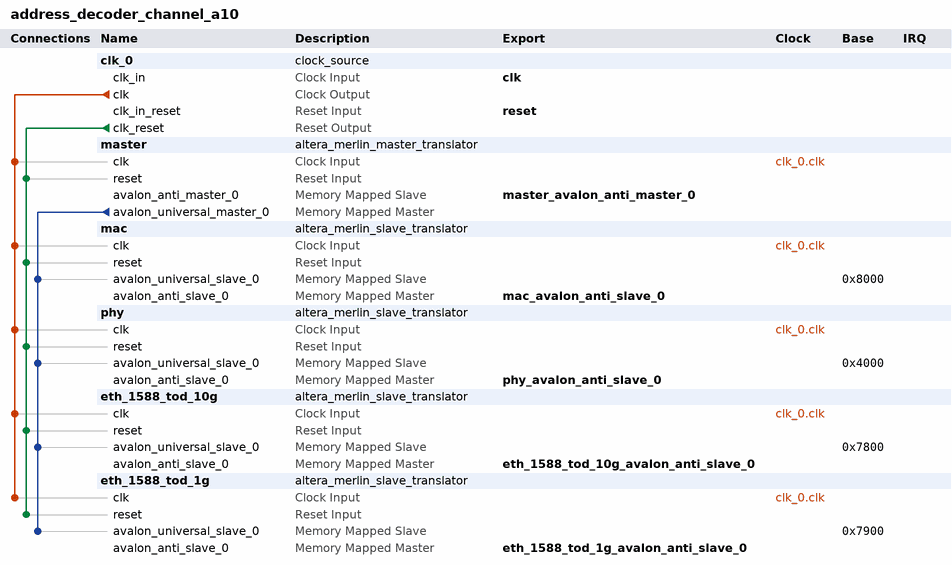
[diagram p0: system contents]
# Platform Designer (Qsys) system address_decoder_channel_a10, Arria 10 10AX115S4F45I3SGE2
# Parameters at their usual value, and those the tool derives, are not listed.
package require -exact qsys 16.1
create_system address_decoder_channel_a10
set_project_property DEVICE_FAMILY {Arria 10}
set_project_property DEVICE 10AX115S4F45I3SGE2

add_instance clk_0 clock_source 16.1
set_instance_parameter_value clk_0 clockFrequency 100000000

add_instance master altera_merlin_master_translator 16.1
set_instance_parameter_value master AV_ADDRESSGROUP 0
set_instance_parameter_value master AV_ADDRESS_SYMBOLS 1
set_instance_parameter_value master AV_ADDRESS_W 16
set_instance_parameter_value master AV_ALWAYSBURSTMAXBURST 0
set_instance_parameter_value master AV_BITS_PER_SYMBOL 8
set_instance_parameter_value master AV_BURSTBOUNDARIES 0
set_instance_parameter_value master AV_BURSTCOUNT_SYMBOLS 1
set_instance_parameter_value master AV_BURSTCOUNT_W 3
set_instance_parameter_value master AV_BYTEENABLE_W 4
set_instance_parameter_value master AV_CONSTANT_BURST_BEHAVIOR 0
set_instance_parameter_value master AV_DATA_HOLD 0
set_instance_parameter_value master AV_DATA_W 32
set_instance_parameter_value master AV_INTERLEAVEBURSTS 0
set_instance_parameter_value master AV_ISBIGENDIAN 0
set_instance_parameter_value master AV_LINEWRAPBURSTS 0
set_instance_parameter_value master AV_MAX_PENDING_READ_TRANSACTIONS 0
set_instance_parameter_value master AV_READLATENCY 0
set_instance_parameter_value master AV_READ_WAIT 0
set_instance_parameter_value master AV_REGISTERINCOMINGSIGNALS 0
set_instance_parameter_value master AV_REGISTEROUTGOINGSIGNALS 0
set_instance_parameter_value master AV_SETUP_WAIT 0
set_instance_parameter_value master AV_SYMBOLS_PER_WORD 4
set_instance_parameter_value master AV_WRITE_WAIT 0
set_instance_parameter_value master SYNC_RESET 0
set_instance_parameter_value master UAV_ADDRESSGROUP 0
set_instance_parameter_value master UAV_ADDRESS_W 32
set_instance_parameter_value master UAV_BURSTCOUNT_W 3
set_instance_parameter_value master UAV_CONSTANT_BURST_BEHAVIOR 0
set_instance_parameter_value master USE_ADDRESS 1
set_instance_parameter_value master USE_BEGINBURSTTRANSFER 0
set_instance_parameter_value master USE_BEGINTRANSFER 0
set_instance_parameter_value master USE_BURSTCOUNT 0
set_instance_parameter_value master USE_BYTEENABLE 0
set_instance_parameter_value master USE_CHIPSELECT 0
set_instance_parameter_value master USE_CLKEN 0
set_instance_parameter_value master USE_DEBUGACCESS 0
set_instance_parameter_value master USE_LOCK 0
set_instance_parameter_value master USE_READ 1
set_instance_parameter_value master USE_READDATA 1
set_instance_parameter_value master USE_READDATAVALID 0
set_instance_parameter_value master USE_READRESPONSE 0
set_instance_parameter_value master USE_WAITREQUEST 1
set_instance_parameter_value master USE_WRITE 1
set_instance_parameter_value master USE_WRITEDATA 1
set_instance_parameter_value master USE_WRITERESPONSE 0

add_instance mac altera_merlin_slave_translator 16.1
set_instance_parameter_value mac AV_ADDRESSGROUP 0
set_instance_parameter_value mac AV_ADDRESS_SYMBOLS 1
set_instance_parameter_value mac AV_ADDRESS_W 15
set_instance_parameter_value mac AV_ALWAYSBURSTMAXBURST 0
set_instance_parameter_value mac AV_BITS_PER_SYMBOL 8
set_instance_parameter_value mac AV_BURSTBOUNDARIES 0
set_instance_parameter_value mac AV_BURSTCOUNT_SYMBOLS 1
set_instance_parameter_value mac AV_BURSTCOUNT_W 1
set_instance_parameter_value mac AV_BYTEENABLE_W 4
set_instance_parameter_value mac AV_CONSTANT_BURST_BEHAVIOR 0
set_instance_parameter_value mac AV_DATA_HOLD 0
set_instance_parameter_value mac AV_DATA_W 32
set_instance_parameter_value mac AV_INTERLEAVEBURSTS 0
set_instance_parameter_value mac AV_ISBIGENDIAN 0
set_instance_parameter_value mac AV_LINEWRAPBURSTS 0
set_instance_parameter_value mac AV_MAX_PENDING_READ_TRANSACTIONS 1
set_instance_parameter_value mac AV_MAX_PENDING_WRITE_TRANSACTIONS 0
set_instance_parameter_value mac AV_READLATENCY 0
set_instance_parameter_value mac AV_READ_WAIT 0
set_instance_parameter_value mac AV_REGISTERINCOMINGSIGNALS 0
set_instance_parameter_value mac AV_REGISTEROUTGOINGSIGNALS 0
set_instance_parameter_value mac AV_REQUIRE_UNALIGNED_ADDRESSES 0
set_instance_parameter_value mac AV_SETUP_WAIT 0
set_instance_parameter_value mac AV_SYMBOLS_PER_WORD 4
set_instance_parameter_value mac AV_TIMING_UNITS 1
set_instance_parameter_value mac AV_WRITE_WAIT 0
set_instance_parameter_value mac CHIPSELECT_THROUGH_READLATENCY 0
set_instance_parameter_value mac CLOCK_RATE 100000000
set_instance_parameter_value mac UAV_ADDRESSGROUP 0
set_instance_parameter_value mac UAV_ADDRESS_W 15
set_instance_parameter_value mac UAV_BURSTCOUNT_W 3
set_instance_parameter_value mac UAV_BYTEENABLE_W 4
set_instance_parameter_value mac UAV_CONSTANT_BURST_BEHAVIOR 0
set_instance_parameter_value mac UAV_DATA_W 32
set_instance_parameter_value mac USE_ADDRESS 1
set_instance_parameter_value mac USE_AV_CLKEN 0
set_instance_parameter_value mac USE_BEGINBURSTTRANSFER 0
set_instance_parameter_value mac USE_BEGINTRANSFER 0
set_instance_parameter_value mac USE_BURSTCOUNT 0
set_instance_parameter_value mac USE_BYTEENABLE 0
set_instance_parameter_value mac USE_CHIPSELECT 0
set_instance_parameter_value mac USE_DEBUGACCESS 0
set_instance_parameter_value mac USE_LOCK 0
set_instance_parameter_value mac USE_OUTPUTENABLE 0
set_instance_parameter_value mac USE_READ 1
set_instance_parameter_value mac USE_READDATA 1
set_instance_parameter_value mac USE_READDATAVALID 0
set_instance_parameter_value mac USE_READRESPONSE 0
set_instance_parameter_value mac USE_UAV_CLKEN 0
set_instance_parameter_value mac USE_WAITREQUEST 1
set_instance_parameter_value mac USE_WRITE 1
set_instance_parameter_value mac USE_WRITEBYTEENABLE 0
set_instance_parameter_value mac USE_WRITEDATA 1
set_instance_parameter_value mac USE_WRITERESPONSE 0

add_instance phy altera_merlin_slave_translator 16.1
set_instance_parameter_value phy AV_ADDRESSGROUP 0
set_instance_parameter_value phy AV_ADDRESS_SYMBOLS 1
set_instance_parameter_value phy AV_ADDRESS_W 13
set_instance_parameter_value phy AV_ALWAYSBURSTMAXBURST 0
set_instance_parameter_value phy AV_BITS_PER_SYMBOL 8
set_instance_parameter_value phy AV_BURSTBOUNDARIES 0
set_instance_parameter_value phy AV_BURSTCOUNT_SYMBOLS 1
set_instance_parameter_value phy AV_BURSTCOUNT_W 1
set_instance_parameter_value phy AV_BYTEENABLE_W 4
set_instance_parameter_value phy AV_CONSTANT_BURST_BEHAVIOR 0
set_instance_parameter_value phy AV_DATA_HOLD 0
set_instance_parameter_value phy AV_DATA_W 32
set_instance_parameter_value phy AV_INTERLEAVEBURSTS 0
set_instance_parameter_value phy AV_ISBIGENDIAN 0
set_instance_parameter_value phy AV_LINEWRAPBURSTS 0
set_instance_parameter_value phy AV_MAX_PENDING_READ_TRANSACTIONS 1
set_instance_parameter_value phy AV_MAX_PENDING_WRITE_TRANSACTIONS 0
set_instance_parameter_value phy AV_READLATENCY 0
set_instance_parameter_value phy AV_READ_WAIT 0
set_instance_parameter_value phy AV_REGISTERINCOMINGSIGNALS 0
set_instance_parameter_value phy AV_REGISTEROUTGOINGSIGNALS 0
set_instance_parameter_value phy AV_REQUIRE_UNALIGNED_ADDRESSES 0
set_instance_parameter_value phy AV_SETUP_WAIT 0
set_instance_parameter_value phy AV_SYMBOLS_PER_WORD 4
set_instance_parameter_value phy AV_TIMING_UNITS 1
set_instance_parameter_value phy AV_WRITE_WAIT 0
set_instance_parameter_value phy CHIPSELECT_THROUGH_READLATENCY 0
set_instance_parameter_value phy CLOCK_RATE 100000000
set_instance_parameter_value phy UAV_ADDRESSGROUP 0
set_instance_parameter_value phy UAV_ADDRESS_W 13
set_instance_parameter_value phy UAV_BURSTCOUNT_W 3
set_instance_parameter_value phy UAV_BYTEENABLE_W 4
set_instance_parameter_value phy UAV_CONSTANT_BURST_BEHAVIOR 0
set_instance_parameter_value phy UAV_DATA_W 32
set_instance_parameter_value phy USE_ADDRESS 1
set_instance_parameter_value phy USE_AV_CLKEN 0
set_instance_parameter_value phy USE_BEGINBURSTTRANSFER 0
set_instance_parameter_value phy USE_BEGINTRANSFER 0
set_instance_parameter_value phy USE_BURSTCOUNT 0
set_instance_parameter_value phy USE_BYTEENABLE 0
set_instance_parameter_value phy USE_CHIPSELECT 0
set_instance_parameter_value phy USE_DEBUGACCESS 0
set_instance_parameter_value phy USE_LOCK 0
set_instance_parameter_value phy USE_OUTPUTENABLE 0
set_instance_parameter_value phy USE_READ 1
set_instance_parameter_value phy USE_READDATA 1
set_instance_parameter_value phy USE_READDATAVALID 0
set_instance_parameter_value phy USE_READRESPONSE 0
set_instance_parameter_value phy USE_UAV_CLKEN 0
set_instance_parameter_value phy USE_WAITREQUEST 1
set_instance_parameter_value phy USE_WRITE 1
set_instance_parameter_value phy USE_WRITEBYTEENABLE 0
set_instance_parameter_value phy USE_WRITEDATA 1
set_instance_parameter_value phy USE_WRITERESPONSE 0

add_instance eth_1588_tod_10g altera_merlin_slave_translator 16.1
set_instance_parameter_value eth_1588_tod_10g AV_ADDRESSGROUP 0
set_instance_parameter_value eth_1588_tod_10g AV_ADDRESS_SYMBOLS 1
set_instance_parameter_value eth_1588_tod_10g AV_ADDRESS_W 6
set_instance_parameter_value eth_1588_tod_10g AV_ALWAYSBURSTMAXBURST 0
set_instance_parameter_value eth_1588_tod_10g AV_BITS_PER_SYMBOL 8
set_instance_parameter_value eth_1588_tod_10g AV_BURSTBOUNDARIES 0
set_instance_parameter_value eth_1588_tod_10g AV_BURSTCOUNT_SYMBOLS 1
set_instance_parameter_value eth_1588_tod_10g AV_BURSTCOUNT_W 1
set_instance_parameter_value eth_1588_tod_10g AV_BYTEENABLE_W 4
set_instance_parameter_value eth_1588_tod_10g AV_CONSTANT_BURST_BEHAVIOR 0
set_instance_parameter_value eth_1588_tod_10g AV_DATA_HOLD 0
set_instance_parameter_value eth_1588_tod_10g AV_DATA_W 32
set_instance_parameter_value eth_1588_tod_10g AV_INTERLEAVEBURSTS 0
set_instance_parameter_value eth_1588_tod_10g AV_ISBIGENDIAN 0
set_instance_parameter_value eth_1588_tod_10g AV_LINEWRAPBURSTS 0
set_instance_parameter_value eth_1588_tod_10g AV_MAX_PENDING_READ_TRANSACTIONS 1
set_instance_parameter_value eth_1588_tod_10g AV_MAX_PENDING_WRITE_TRANSACTIONS 0
set_instance_parameter_value eth_1588_tod_10g AV_READLATENCY 0
set_instance_parameter_value eth_1588_tod_10g AV_READ_WAIT 0
set_instance_parameter_value eth_1588_tod_10g AV_REGISTERINCOMINGSIGNALS 0
set_instance_parameter_value eth_1588_tod_10g AV_REGISTEROUTGOINGSIGNALS 0
set_instance_parameter_value eth_1588_tod_10g AV_REQUIRE_UNALIGNED_ADDRESSES 0
set_instance_parameter_value eth_1588_tod_10g AV_SETUP_WAIT 0
set_instance_parameter_value eth_1588_tod_10g AV_SYMBOLS_PER_WORD 4
set_instance_parameter_value eth_1588_tod_10g AV_TIMING_UNITS 1
set_instance_parameter_value eth_1588_tod_10g AV_WRITE_WAIT 0
set_instance_parameter_value eth_1588_tod_10g CHIPSELECT_THROUGH_READLATENCY 0
set_instance_parameter_value eth_1588_tod_10g CLOCK_RATE 100000000
set_instance_parameter_value eth_1588_tod_10g UAV_ADDRESSGROUP 0
set_instance_parameter_value eth_1588_tod_10g UAV_ADDRESS_W 6
set_instance_parameter_value eth_1588_tod_10g UAV_BURSTCOUNT_W 3
set_instance_parameter_value eth_1588_tod_10g UAV_BYTEENABLE_W 4
set_instance_parameter_value eth_1588_tod_10g UAV_CONSTANT_BURST_BEHAVIOR 0
set_instance_parameter_value eth_1588_tod_10g UAV_DATA_W 32
set_instance_parameter_value eth_1588_tod_10g USE_ADDRESS 1
set_instance_parameter_value eth_1588_tod_10g USE_AV_CLKEN 0
set_instance_parameter_value eth_1588_tod_10g USE_BEGINBURSTTRANSFER 0
set_instance_parameter_value eth_1588_tod_10g USE_BEGINTRANSFER 0
set_instance_parameter_value eth_1588_tod_10g USE_BURSTCOUNT 0
set_instance_parameter_value eth_1588_tod_10g USE_BYTEENABLE 0
set_instance_parameter_value eth_1588_tod_10g USE_CHIPSELECT 0
set_instance_parameter_value eth_1588_tod_10g USE_DEBUGACCESS 0
set_instance_parameter_value eth_1588_tod_10g USE_LOCK 0
set_instance_parameter_value eth_1588_tod_10g USE_OUTPUTENABLE 0
set_instance_parameter_value eth_1588_tod_10g USE_READ 1
set_instance_parameter_value eth_1588_tod_10g USE_READDATA 1
set_instance_parameter_value eth_1588_tod_10g USE_READDATAVALID 0
set_instance_parameter_value eth_1588_tod_10g USE_READRESPONSE 0
set_instance_parameter_value eth_1588_tod_10g USE_UAV_CLKEN 0
set_instance_parameter_value eth_1588_tod_10g USE_WAITREQUEST 1
set_instance_parameter_value eth_1588_tod_10g USE_WRITE 1
set_instance_parameter_value eth_1588_tod_10g USE_WRITEBYTEENABLE 0
set_instance_parameter_value eth_1588_tod_10g USE_WRITEDATA 1
set_instance_parameter_value eth_1588_tod_10g USE_WRITERESPONSE 0

add_instance eth_1588_tod_1g altera_merlin_slave_translator 16.1
set_instance_parameter_value eth_1588_tod_1g AV_ADDRESSGROUP 0
set_instance_parameter_value eth_1588_tod_1g AV_ADDRESS_SYMBOLS 1
set_instance_parameter_value eth_1588_tod_1g AV_ADDRESS_W 6
set_instance_parameter_value eth_1588_tod_1g AV_ALWAYSBURSTMAXBURST 0
set_instance_parameter_value eth_1588_tod_1g AV_BITS_PER_SYMBOL 8
set_instance_parameter_value eth_1588_tod_1g AV_BURSTBOUNDARIES 0
set_instance_parameter_value eth_1588_tod_1g AV_BURSTCOUNT_SYMBOLS 1
set_instance_parameter_value eth_1588_tod_1g AV_BURSTCOUNT_W 1
set_instance_parameter_value eth_1588_tod_1g AV_BYTEENABLE_W 4
set_instance_parameter_value eth_1588_tod_1g AV_CONSTANT_BURST_BEHAVIOR 0
set_instance_parameter_value eth_1588_tod_1g AV_DATA_HOLD 0
set_instance_parameter_value eth_1588_tod_1g AV_DATA_W 32
set_instance_parameter_value eth_1588_tod_1g AV_INTERLEAVEBURSTS 0
set_instance_parameter_value eth_1588_tod_1g AV_ISBIGENDIAN 0
set_instance_parameter_value eth_1588_tod_1g AV_LINEWRAPBURSTS 0
set_instance_parameter_value eth_1588_tod_1g AV_MAX_PENDING_READ_TRANSACTIONS 1
set_instance_parameter_value eth_1588_tod_1g AV_MAX_PENDING_WRITE_TRANSACTIONS 0
set_instance_parameter_value eth_1588_tod_1g AV_READLATENCY 0
set_instance_parameter_value eth_1588_tod_1g AV_READ_WAIT 0
set_instance_parameter_value eth_1588_tod_1g AV_REGISTERINCOMINGSIGNALS 0
set_instance_parameter_value eth_1588_tod_1g AV_REGISTEROUTGOINGSIGNALS 0
set_instance_parameter_value eth_1588_tod_1g AV_REQUIRE_UNALIGNED_ADDRESSES 0
set_instance_parameter_value eth_1588_tod_1g AV_SETUP_WAIT 0
set_instance_parameter_value eth_1588_tod_1g AV_SYMBOLS_PER_WORD 4
set_instance_parameter_value eth_1588_tod_1g AV_TIMING_UNITS 1
set_instance_parameter_value eth_1588_tod_1g AV_WRITE_WAIT 0
set_instance_parameter_value eth_1588_tod_1g CHIPSELECT_THROUGH_READLATENCY 0
set_instance_parameter_value eth_1588_tod_1g CLOCK_RATE 100000000
set_instance_parameter_value eth_1588_tod_1g UAV_ADDRESSGROUP 0
set_instance_parameter_value eth_1588_tod_1g UAV_ADDRESS_W 6
set_instance_parameter_value eth_1588_tod_1g UAV_BURSTCOUNT_W 3
set_instance_parameter_value eth_1588_tod_1g UAV_BYTEENABLE_W 4
set_instance_parameter_value eth_1588_tod_1g UAV_CONSTANT_BURST_BEHAVIOR 0
set_instance_parameter_value eth_1588_tod_1g UAV_DATA_W 32
set_instance_parameter_value eth_1588_tod_1g USE_ADDRESS 1
set_instance_parameter_value eth_1588_tod_1g USE_AV_CLKEN 0
set_instance_parameter_value eth_1588_tod_1g USE_BEGINBURSTTRANSFER 0
set_instance_parameter_value eth_1588_tod_1g USE_BEGINTRANSFER 0
set_instance_parameter_value eth_1588_tod_1g USE_BURSTCOUNT 0
set_instance_parameter_value eth_1588_tod_1g USE_BYTEENABLE 0
set_instance_parameter_value eth_1588_tod_1g USE_CHIPSELECT 0
set_instance_parameter_value eth_1588_tod_1g USE_DEBUGACCESS 0
set_instance_parameter_value eth_1588_tod_1g USE_LOCK 0
set_instance_parameter_value eth_1588_tod_1g USE_OUTPUTENABLE 0
set_instance_parameter_value eth_1588_tod_1g USE_READ 1
set_instance_parameter_value eth_1588_tod_1g USE_READDATA 1
set_instance_parameter_value eth_1588_tod_1g USE_READDATAVALID 0
set_instance_parameter_value eth_1588_tod_1g USE_READRESPONSE 0
set_instance_parameter_value eth_1588_tod_1g USE_UAV_CLKEN 0
set_instance_parameter_value eth_1588_tod_1g USE_WAITREQUEST 1
set_instance_parameter_value eth_1588_tod_1g USE_WRITE 1
set_instance_parameter_value eth_1588_tod_1g USE_WRITEBYTEENABLE 0
set_instance_parameter_value eth_1588_tod_1g USE_WRITEDATA 1
set_instance_parameter_value eth_1588_tod_1g USE_WRITERESPONSE 0

# connections
add_connection clk_0.clk eth_1588_tod_1g.clk clock
add_connection clk_0.clk eth_1588_tod_10g.clk clock
add_connection clk_0.clk mac.clk clock
add_connection clk_0.clk master.clk clock
add_connection clk_0.clk phy.clk clock
add_connection clk_0.clk_reset eth_1588_tod_1g.reset reset
add_connection clk_0.clk_reset eth_1588_tod_10g.reset reset
add_connection clk_0.clk_reset mac.reset reset
add_connection clk_0.clk_reset master.reset reset
add_connection clk_0.clk_reset phy.reset reset
add_connection master.avalon_universal_master_0 eth_1588_tod_1g.avalon_universal_slave_0 avalon
set_connection_parameter_value master.avalon_universal_master_0/eth_1588_tod_1g.avalon_universal_slave_0 baseAddress 0x7900
add_connection master.avalon_universal_master_0 eth_1588_tod_10g.avalon_universal_slave_0 avalon
set_connection_parameter_value master.avalon_universal_master_0/eth_1588_tod_10g.avalon_universal_slave_0 baseAddress 0x7800
add_connection master.avalon_universal_master_0 mac.avalon_universal_slave_0 avalon
set_connection_parameter_value master.avalon_universal_master_0/mac.avalon_universal_slave_0 baseAddress 0x8000
add_connection master.avalon_universal_master_0 phy.avalon_universal_slave_0 avalon
set_connection_parameter_value master.avalon_universal_master_0/phy.avalon_universal_slave_0 baseAddress 0x4000

# exported interfaces
add_interface clk clock sink
set_interface_property clk EXPORT_OF clk_0.clk_in
add_interface eth_1588_tod_10g_avalon_anti_slave_0 avalon master
set_interface_property eth_1588_tod_10g_avalon_anti_slave_0 EXPORT_OF eth_1588_tod_10g.avalon_anti_slave_0
add_interface eth_1588_tod_1g_avalon_anti_slave_0 avalon master
set_interface_property eth_1588_tod_1g_avalon_anti_slave_0 EXPORT_OF eth_1588_tod_1g.avalon_anti_slave_0
add_interface mac_avalon_anti_slave_0 avalon master
set_interface_property mac_avalon_anti_slave_0 EXPORT_OF mac.avalon_anti_slave_0
add_interface master_avalon_anti_master_0 avalon slave
set_interface_property master_avalon_anti_master_0 EXPORT_OF master.avalon_anti_master_0
add_interface phy_avalon_anti_slave_0 avalon master
set_interface_property phy_avalon_anti_slave_0 EXPORT_OF phy.avalon_anti_slave_0
add_interface reset reset sink
set_interface_property reset EXPORT_OF clk_0.clk_in_reset

set_interconnect_requirement {$system} qsys_mm.clockCrossingAdapter HANDSHAKE
set_interconnect_requirement {$system} qsys_mm.maxAdditionalLatency 1

save_system address_decoder_channel_a10.qsys
